# Altium schematic sheet Display.SchDoc: SR4K_PHY6222
size A4; Revision: V1.2; SheetNumber: 3; SheetTotal: 5
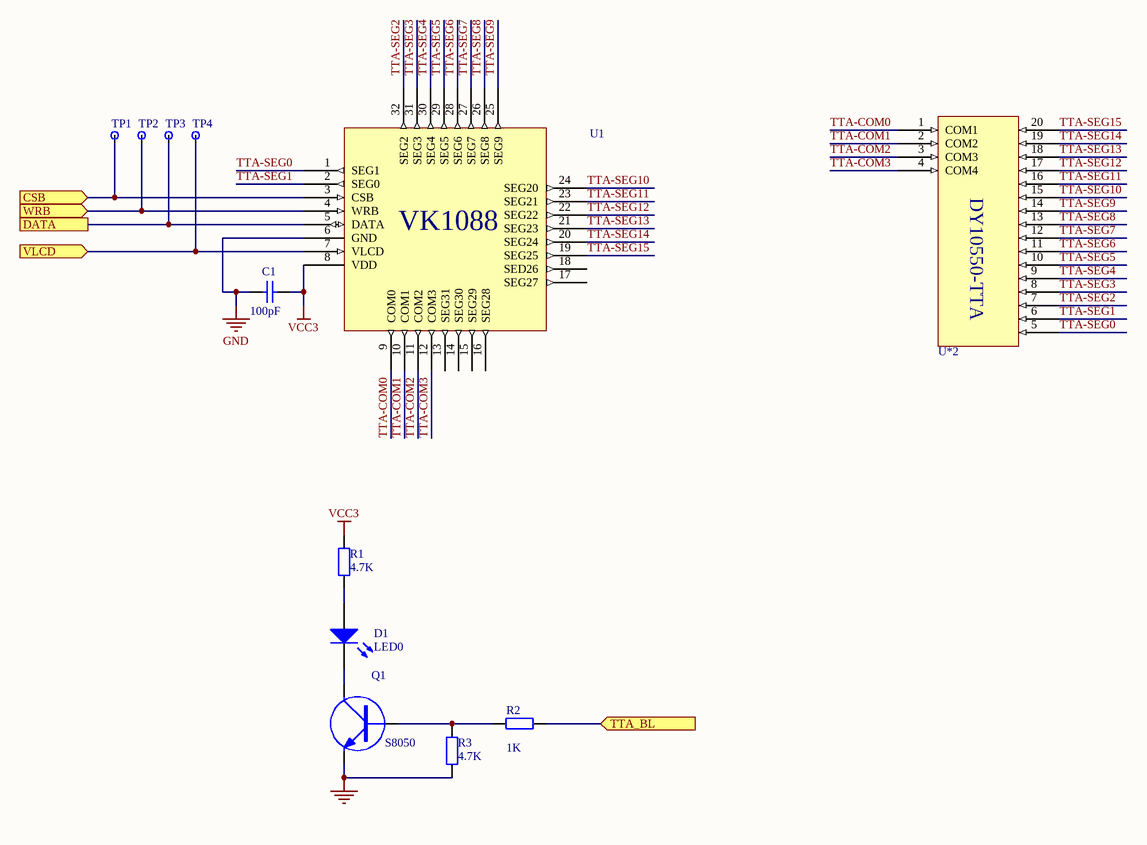
[diagram p0: Display.SchDoc]

## Parts
C1  value 100pF  [RAD-0.3]  (hidden comment: Cap)
D1  LED0
Q1  S8050
R1  value 4.7K  (hidden comment: Res2)
R2  value 1K  (hidden comment: Res2)
R3  value 4.7K  (hidden comment: 100K)
TP1  TP  (value not drawn)
TP2  TP  (value not drawn)
TP3  TP  (value not drawn)
TP4  TP  (value not drawn)
U1  U*  (value not drawn)
U*2  DY10550-TTA  (value not drawn)

## Ports
CSB (in), DATA, TTA_BL (in), VLCD (in), WRB (in)

## Nets
GND: C1.1 Q1.2(E) R3.1 U1.6(GND)
VCC3: C1.2 R1.2 U1.8(VDD)
CSB: TP1.0 U1.3(CSB) ; port CSB
DATA: TP3.0 U1.5(DATA) ; port DATA
TTA-COM0: U1.9(COM0) U*2.1(COM1)
TTA-COM1: U1.10(COM1) U*2.2(COM2)
TTA-COM2: U1.11(COM2) U*2.3(COM3)
TTA-COM3: U1.12(COM3) U*2.4(COM4)
TTA-SEG0: U1.1(SEG1) U*2.5
TTA-SEG1: U1.2(SEG0) U*2.6
TTA-SEG2: U1.32(SEG2) U*2.7
TTA-SEG3: U1.31(SEG3) U*2.8
TTA-SEG4: U1.30(SEG4) U*2.9
TTA-SEG5: U1.29(SEG5) U*2.10
TTA-SEG6: U1.28(SEG6) U*2.11
TTA-SEG7: U1.27(SEG7) U*2.12
TTA-SEG8: U1.26(SEG8) U*2.13
TTA-SEG9: U1.25(SEG9) U*2.14
TTA-SEG10: U1.24(SEG20) U*2.15
TTA-SEG11: U1.23(SEG21) U*2.16
TTA-SEG12: U1.22(SEG22) U*2.17
TTA-SEG13: U1.21(SEG23) U*2.18
TTA-SEG14: U1.20(SEG24) U*2.19
TTA-SEG15: U1.19(SEG25) U*2.20
TTA_BL: R2.2 ; port TTA_BL
VLCD: TP4.0 U1.7(VLCD) ; port VLCD
WRB: TP2.0 U1.4(WRB) ; port WRB
NetD1_1: D1.1(A) R1.1
NetD1_2: D1.2(K) Q1.3(C)
NetQ1_1: Q1.1(B) R2.1 R3.2

Not connected (* = marked no-connect by the designer): U1 13(SEG31) 14(SEG30) 15(SEG29) 16(SEG28) 17(SEG27) 18(SED26)

## Notes on the sheet
- Title
- Size:
- Date:
- A4
- Number:
- Time:
- Revision:
- Sheet
- emmovo@outlook.com
- of
- File:

## Library data of the parts
C1 = Cap: Capacitor; Published: 8-Jun-2000; LatestRevisionDate: 17-Jul-2002; LatestRevisionNote: Re-released for DXP Platform.; PackageReference: RAD-0.3; Publisher: Altium Limited; PackageDescription: Radial Cap, Thru-Hole; 2 Leads; 0.3 in Pin Spacing
D1 = LED0: Typical INFRARED GaAs LED; Published: 8-Jun-2000; LatestRevisionDate: 08-Jul-2005; LatestRevisionNote: Mech Layer 1 removed.; PackageReference: LED-0; Publisher: Altium Limited; PackageDescription: LED; 2 Leads
Q1 = NPN: NPN Transistor
R1-R3 = Res2: Resistor; Published: 8-Jun-2000; LatestRevisionDate: 17-Jul-2002; LatestRevisionNote: Re-released for DXP Platform.; PackageReference: AXIAL-0.4; Publisher: Altium Limited; PackageDescription: Axial Device, Thru-Hole; 2 Leads; 0.4 in Pin Spacing
U1 = VK1088